# Altium schematic sheet NMT_FREQ_CNT.SCHDOC
size A4; Organization: Altium Limited; Address1: L3, 12a Rodborough Rd; Address2: Frenchs Forest; Address3: NSW; Address4: Australia 2086; DocumentNumber: 12; SheetNumber: 2; SheetTotal: 13
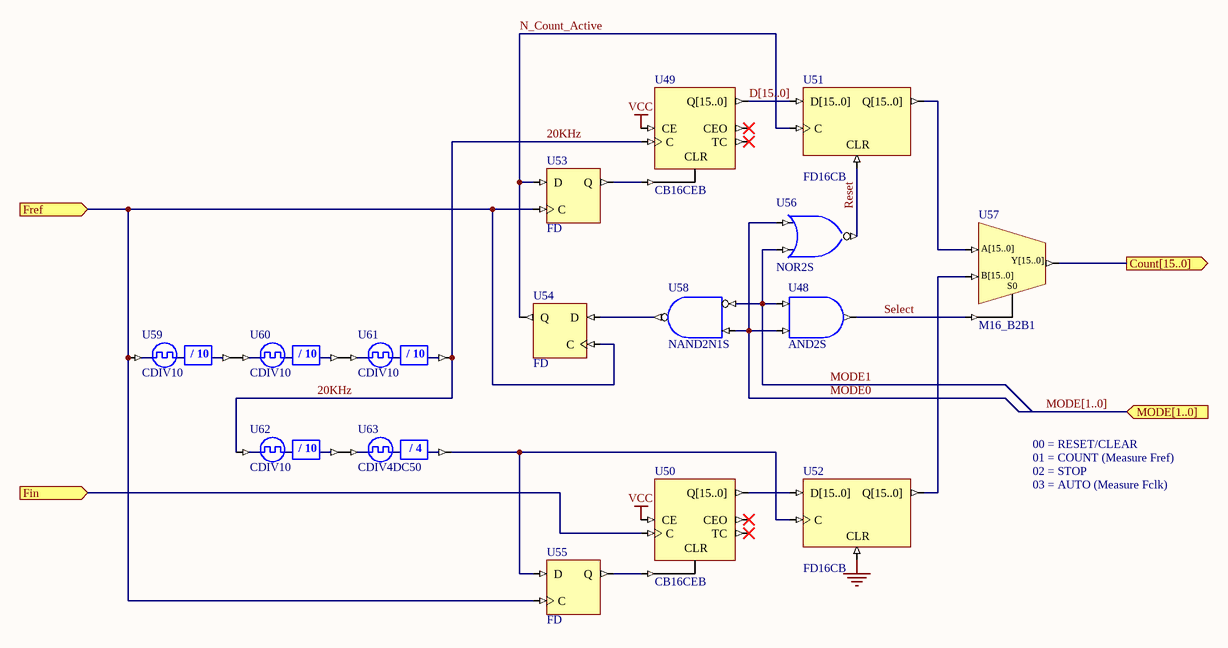
[diagram p0: NMT_FREQ_CNT.SCHDOC]

## Parts
U48  AND2S
U49  CB16CEB
U50  CB16CEB
U51  FD16CB
U52  FD16CB
U53  FD
U54  FD
U55  FD
U56  NOR2S
U57  M16_B2B1
U58  NAND2N1S
U59  CDIV10
U60  CDIV10
U61  CDIV10
U62  CDIV10
U63  CDIV4DC50

## Ports
Count[15..0] (out), Fin (in), Fref (in), MODE[1..0] (in)

## Nets
GND: U52.CLR
VCC: U49.CE U50.CE
20KHz: U49.C U61.CLKDV U62.CLKIN
Count[15..0]: U57.Y[15..0] ; port Count[15..0]
D[15..0]: U49.Q[15..0] U51.D[15..0]
Fin: U50.C ; port Fin
Fref: U53.C U54.C U55.C U59.CLKIN ; port Fref
MODE0: U48.I1 U56.I0 U58.I1
MODE1: U48.I0 U56.I1 U58.I0
N_Count_Active: U51.C U53.D U54.Q
Reset: U51.CLR U56.O
Select: U48.O U57.S0
NetU49_CLR: U49.CLR U53.Q
NetU50_CLR: U50.CLR U55.Q
NetU50_Q[15..0]: U50.Q[15..0] U52.D[15..0]
NetU51_Q[15..0]: U51.Q[15..0] U57.A[15..0]
NetU52_C: U52.C U55.D U63.CLKDV
NetU52_Q[15..0]: U52.Q[15..0] U57.B[15..0]
NetU54_D: U54.D U58.O
NetU59_CLKDV: U59.CLKDV U60.CLKIN
NetU60_CLKDV: U60.CLKDV U61.CLKIN
NetU62_CLKDV: U62.CLKDV U63.CLKIN

Not connected (* = marked no-connect by the designer): U49 CEO* TC*; U50 CEO* TC*

## Buses and harness runs
bus D[15..0]
bus MODE[1..0] = port MODE[1..0]

## Notes on the sheet
- 00 = RESET/CLEAR
- 01 = COUNT (Measure Fref)
- 02 = STOP
- 03 = AUTO (Measure Fclk)
- Title
- Size:
- Date:
- A4
- Number:
- Time:
- Revision:
- Sheet
- of
- File:
- (in symbol CDIV4DC50) / 4
- (in symbol CDIV10) / 10

## Library data of the parts
U48 = AND2S: 2-Input AND Gate, Single Pin Version; Xilinx Equivalent: AND2; ArchiveName: GENERIC; VHDLIB_SIM: GENERIC_LIB; Published: 29-Jan-2004; Publisher: Altium Limited; Core Revision: 1.00.00
U49 U50 = CB16CEB: 16-Bit Cascadable Binary Counters with Clock Enable and Asynchronous Clear, Bus Version; Xilinx Equivalent: CB16CE; ArchiveName: GENERIC; Published: 7-Nov-2003; Publisher: Altium Limited; Core Revision: 1.00.00
U51 U52 = FD16CB: 16-Bit D-Type Flip-Flop with Asynchronous Clear, Bus Version; ArchiveName: GENERIC; Published: 18-Dec-2003; Publisher: Altium Limited; Core Revision: 1.00.00
U53 U55 = FD: D-Type Flip-Flop; ArchiveName: GENERIC; Published: 18-Dec-2003; Publisher: Altium Limited; Xilinx Equivalent: FD; Core Revision: 1.00.00
U54 = FD: D-Type Flip-Flop; ArchiveName: GENERIC; VHDLIB_SIM: GENERIC_LIB; Published: 29-Jan-2004; Publisher: Altium Limited; Xilinx Equivalent: FD; Core Revision: 1.00.00
U56 = NOR2S: 2-Input NOR Gate, Single Pin Version; Xilinx Equivalent: NOR2; ArchiveName: GENERIC; VHDLIB_SIM: GENERIC_LIB; Published: 29-Jan-2004; Publisher: Altium Limited; Core Revision: 1.00.00
U57 = M16_B2B1: 2x16-Bit Bus to 1x16-Bit Bus Multiplexer; ArchiveName: GENERIC; VHDLIB_SIM: GENERIC_LIB; Published: 29-Jan-2004; Publisher: Altium Limited; Core Revision: 1.00.00
U58 = NAND2N1S: 2-Input NAND Gate with Active Low A Input, Single Pin Version; Xilinx Equivalent: NAND2B1; ArchiveName: GENERIC; VHDLIB_SIM: GENERIC_LIB; Published: 29-Jan-2004; Publisher: Altium Limited; Core Revision: 1.00.00
U59-U62 = CDIV10: Clock Divider by 10; ArchiveName: GENERIC; Published: 7-Nov-2003; Publisher: Altium Limited; Core Revision: 1.00.00
U63 = CDIV4DC50: Clock Divider by 4 with 50% Duty Cycle Output; Xilinx Equivalent: CLK_DIV4; ArchiveName: GENERIC; Published: 7-Nov-2003; Publisher: Altium Limited; Core Revision: 1.00.00